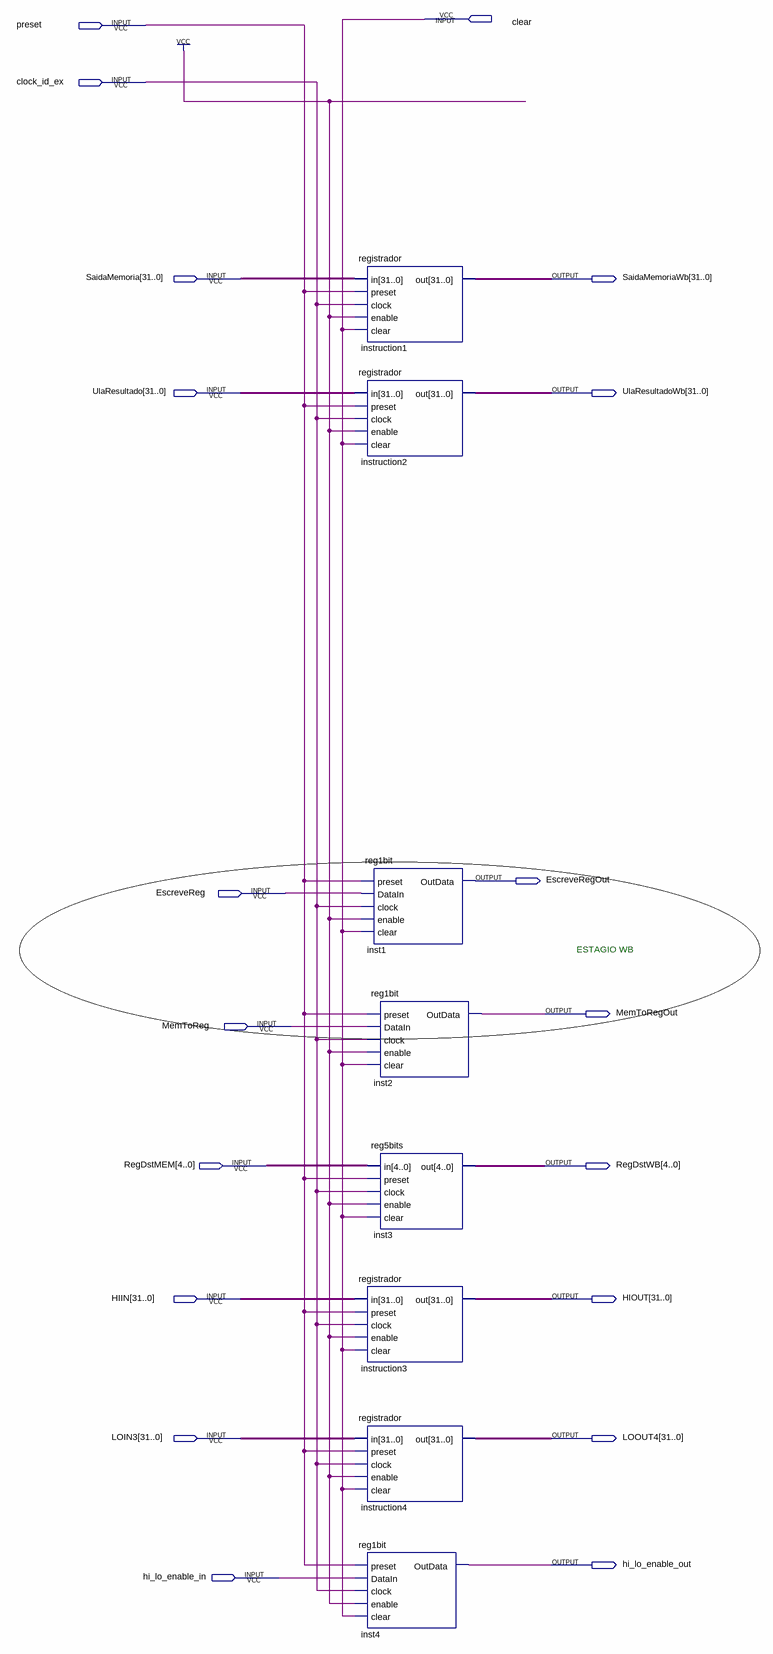
[diagram p0: schematic sheet]
// Quartus schematic MEMWB.bdf as structural Verilog: 8 symbols, 19 pins
module MEMWB (
  input  clear,
  input  preset,
  input  clock_id_ex,
  input  [31:0] SaidaMemoria,
  input  [31:0] UlaResultado,
  input  EscreveReg,
  input  MemToReg,
  input  [4:0] RegDstMEM,
  input  [31:0] HIIN,
  input  [31:0] LOIN3,
  input  hi_lo_enable_in,
  output [31:0] SaidaMemoriaWb,
  output [31:0] UlaResultadoWb,
  output EscreveRegOut,
  output MemToRegOut,
  output [4:0] RegDstWB,
  output [31:0] HIOUT,
  output [31:0] LOOUT4,
  output hi_lo_enable_out
);

  registrador instruction1 (
    .in(SaidaMemoria), .preset(preset), .clock(clock_id_ex), .enable(1'b1), .clear(clear),
    .out(SaidaMemoriaWb));
  registrador instruction2 (
    .in(UlaResultado), .preset(preset), .clock(clock_id_ex), .enable(1'b1), .clear(clear),
    .out(UlaResultadoWb));
  reg1bit inst1 (
    .preset(preset), .DataIn(EscreveReg), .clock(clock_id_ex), .enable(1'b1), .clear(clear),
    .OutData(EscreveRegOut));
  reg1bit inst2 (
    .preset(preset), .DataIn(MemToReg), .clock(clock_id_ex), .enable(1'b1), .clear(clear),
    .OutData(MemToRegOut));
  reg5bits inst3 (.in(RegDstMEM), .preset(preset), .clock(clock_id_ex), .enable(1'b1), .clear(clear), .out(RegDstWB));
  registrador instruction3 (.in(HIIN), .preset(preset), .clock(clock_id_ex), .enable(1'b1), .clear(clear), .out(HIOUT));
  registrador instruction4 (
    .in(LOIN3), .preset(preset), .clock(clock_id_ex), .enable(1'b1), .clear(clear), .out(LOOUT4));
  reg1bit inst4 (
    .preset(preset), .DataIn(hi_lo_enable_in), .clock(clock_id_ex), .enable(1'b1), .clear(clear),
    .OutData(hi_lo_enable_out));

  // Notes on the sheet:
  //   ESTAGIO WB
endmodule
